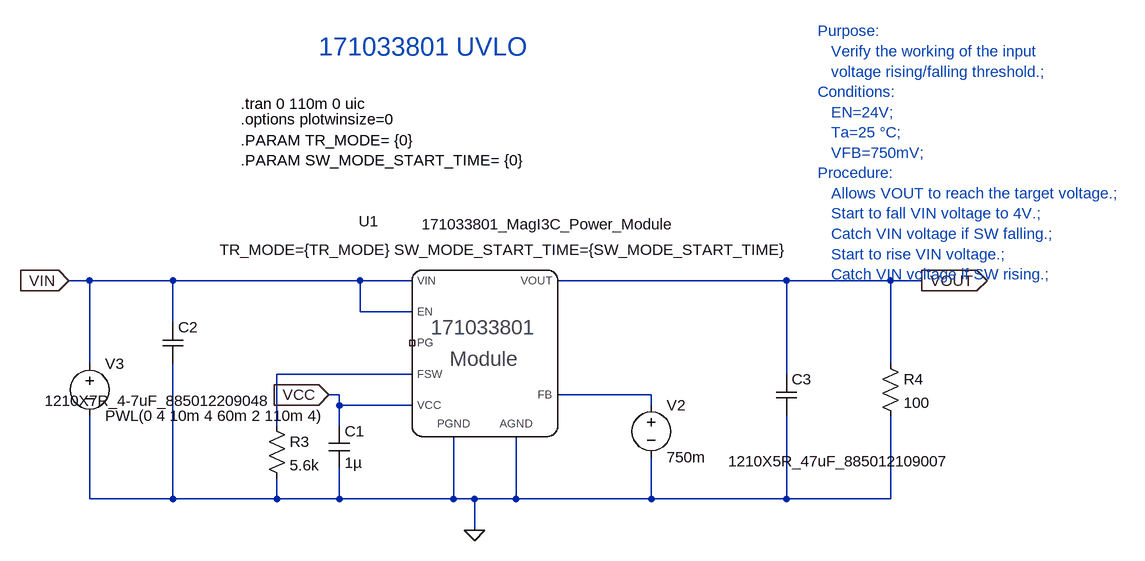
[diagram p0: schematic 171033801 UVLO.asc]
171033801 UVLO.asc, the LTspice schematic file:
Version 4
SHEET 1 1600 680
WIRE -384 48 -416 48
WIRE -256 48 -384 48
WIRE 32 48 -256 48
WIRE 112 48 32 48
WIRE 688 48 336 48
WIRE 848 48 688 48
WIRE 896 48 848 48
WIRE 32 96 32 48
WIRE 112 96 32 96
WIRE -256 112 -256 48
WIRE -384 176 -384 48
WIRE 848 176 848 48
WIRE 112 192 -96 192
WIRE 688 192 688 48
WIRE 0 224 -16 224
WIRE 480 224 336 224
WIRE 0 240 0 224
WIRE 112 240 0 240
WIRE 480 240 480 224
WIRE -96 272 -96 192
WIRE 0 272 0 240
WIRE -384 384 -384 256
WIRE -256 384 -256 176
WIRE -256 384 -384 384
WIRE -96 384 -96 352
WIRE -96 384 -256 384
WIRE 0 384 0 336
WIRE 0 384 -96 384
WIRE 176 384 176 288
WIRE 176 384 0 384
WIRE 208 384 176 384
WIRE 272 384 272 288
WIRE 272 384 208 384
WIRE 480 384 480 320
WIRE 480 384 272 384
WIRE 688 384 688 256
WIRE 688 384 480 384
WIRE 848 384 848 256
WIRE 848 384 688 384
WIRE 208 432 208 384
FLAG 208 432 0
FLAG -416 48 VIN
IOPIN -416 48 In
FLAG 896 48 VOUT
IOPIN 896 48 Out
FLAG -16 224 VCC
IOPIN -16 224 In
SYMBOL res -112 256 R0
SYMATTR InstName R3
SYMATTR Value 5.6k
SYMBOL cap -16 272 R0
SYMATTR InstName C1
SYMATTR Value 1µ
SYMATTR SpiceLine Rser=7.13m Lser=257p
SYMBOL res 832 160 R0
SYMATTR InstName R4
SYMATTR Value 100
SYMBOL voltage 480 224 R0
WINDOW 123 0 0 Left 0
WINDOW 39 0 0 Left 0
SYMATTR InstName V2
SYMATTR Value 750m
SYMBOL voltage -384 160 R0
WINDOW 123 24 124 Left 2
WINDOW 39 20 127 Left 2
SYMATTR InstName V3
SYMATTR Value PWL(0 4 10m 4 60m 2 110m 4)
SYMBOL Contrib\\Wurth\\Capacitors\\MLCC\\WCAP-CSGP\\WCAP-CSGP_50V_DCbias -272 112 R0
WINDOW 38 -181 121 Left 2
SYMATTR SpiceModel 1210X7R_4-7uF_885012209048
SYMATTR InstName C2
SYMBOL Contrib\\Wurth\\Capacitors\\MLCC\\WCAP-CSGP\\WCAP-CSGP_10V_DCbias 672 192 R0
WINDOW 38 -74 134 Left 2
SYMATTR SpiceModel 1210X5R_47uF_885012109007
SYMATTR InstName C3
SYMBOL 171033801_MagI3C_Power_Module 256 64 R0
SYMATTR InstName U1
TEXT -32 -312 Left 4 ;171033801 UVLO
TEXT 736 -336 Left 2 ;Purpose: \n   Verify the working of the input \n   voltage rising/falling threshold.; \nConditions: \n   EN=24V; \n   Ta=25 °C; \n   VFB=750mV; \nProcedure: \n   Allows VOUT to reach the target voltage.; \n   Start to fall VIN voltage to 4V.; \n   Catch VIN voltage if SW falling.; \n   Start to rise VIN voltage.; \n   Catch VIN voltage if SW rising.;
TEXT -152 -224 Left 2 !.tran 0 110m 0 uic
TEXT -152 -200 Left 2 !.options plotwinsize=0
TEXT -152 -168 Left 2 !.PARAM TR_MODE= {0}\n.PARAM SW_MODE_START_TIME= {0}

The netlist it stands for:
* 171033801 UVLO.asc
R3 N001 0 5.6k
C1 VCC 0 1µ Rser=7.13m Lser=257p
R4 VOUT 0 100
V2 N002 0 750m
V3 VIN 0 PWL(0 4 10m 4 60m 2 110m 4)
XC2 VIN 0 1210X7R_4-7uF_885012209048  ; pins A B
XC3 VOUT 0 1210X5R_47uF_885012109007  ; pins A B
XU1 VOUT N002 VIN VIN NC_01 N001 VCC 0 0 171033801_MagI3C_Power_Module TR_MODE={TR_MODE} SW_MODE_START_TIME={SW_MODE_START_TIME}  ; pins VOUT FB VIN EN PG FSW VCC PGND AGND
* 171033801 UVLO
* Purpose:
*    Verify the working of the input
*    voltage rising/falling threshold.;
* Conditions:
*    EN=24V;
*    Ta=25 °C;
*    VFB=750mV;
* Procedure:
*    Allows VOUT to reach the target voltage.;
*    Start to fall VIN voltage to 4V.;
*    Catch VIN voltage if SW falling.;
*    Start to rise VIN voltage.;
*    Catch VIN voltage if SW rising.;
.tran 0 110m 0 uic
.options plotwinsize=0
.PARAM TR_MODE= {0}
.PARAM SW_MODE_START_TIME= {0}
.lib WCAP-CSGP_50V_DCbias.lib
.lib WCAP-CSGP_10V_DCbias.lib
.lib 171033801.lib
.backanno
.end